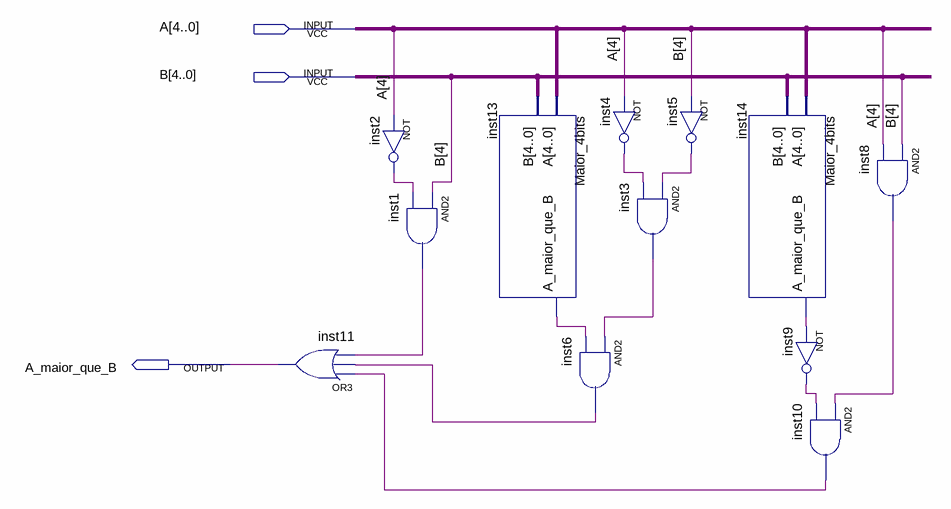
[diagram p0: schematic sheet]
// Quartus schematic Maior_5bits.bdf as structural Verilog: 12 symbols, 3 pins
module Maior_5bits (
  input  [4:0] A,
  input  [4:0] B,
  output A_maior_que_B
);

  wire inst1_out, inst2_out, inst3_out, inst4_out, inst5_out, inst6_out, inst8_out, inst9_out, inst10_out,
       inst13_a_maior_que_b, inst14_a_maior_que_b;

  or inst11 (A_maior_que_B, inst10_out, inst6_out, inst1_out);
  not inst2 (inst2_out, A[4]);
  and inst1 (inst1_out, B[4], inst2_out);
  Maior_4bits inst13 (.A(A), .B(B), .A_maior_que_B(inst13_a_maior_que_b));
  and inst6 (inst6_out, inst3_out, inst13_a_maior_que_b);
  not inst4 (inst4_out, A[4]);
  not inst5 (inst5_out, B[4]);
  and inst3 (inst3_out, inst5_out, inst4_out);
  Maior_4bits inst14 (.A(A), .B(B), .A_maior_que_B(inst14_a_maior_que_b));
  not inst9 (inst9_out, inst14_a_maior_que_b);
  and inst10 (inst10_out, inst8_out, inst9_out);
  and inst8 (inst8_out, B[4], A[4]);
endmodule
